# Altium project AMPURR.PrjPcb (part 2 of 2)

## Sheet ADAU1452KCPZ.SchDoc: =DocumentName
size 420 x 297 mm; Author: Kozyr.I; CompanyName: "AS Manufacturing" LLC; Organization: "AS Manufacturing" LLC; Address1: 5 Sklyarenka St.; Address2: Kyiv 04073; Address3: Ukraine; Address4: https://ajax.systems/en/; DocumentNumber: 1; Revision: v1.0.0; SheetNumber: 1; SheetTotal: 6; Product name: AMPURR; Head: AMPURR..v1.0.0; PCB_Designator: AMPURR..v1.0.0; Template_version: 1.0.1
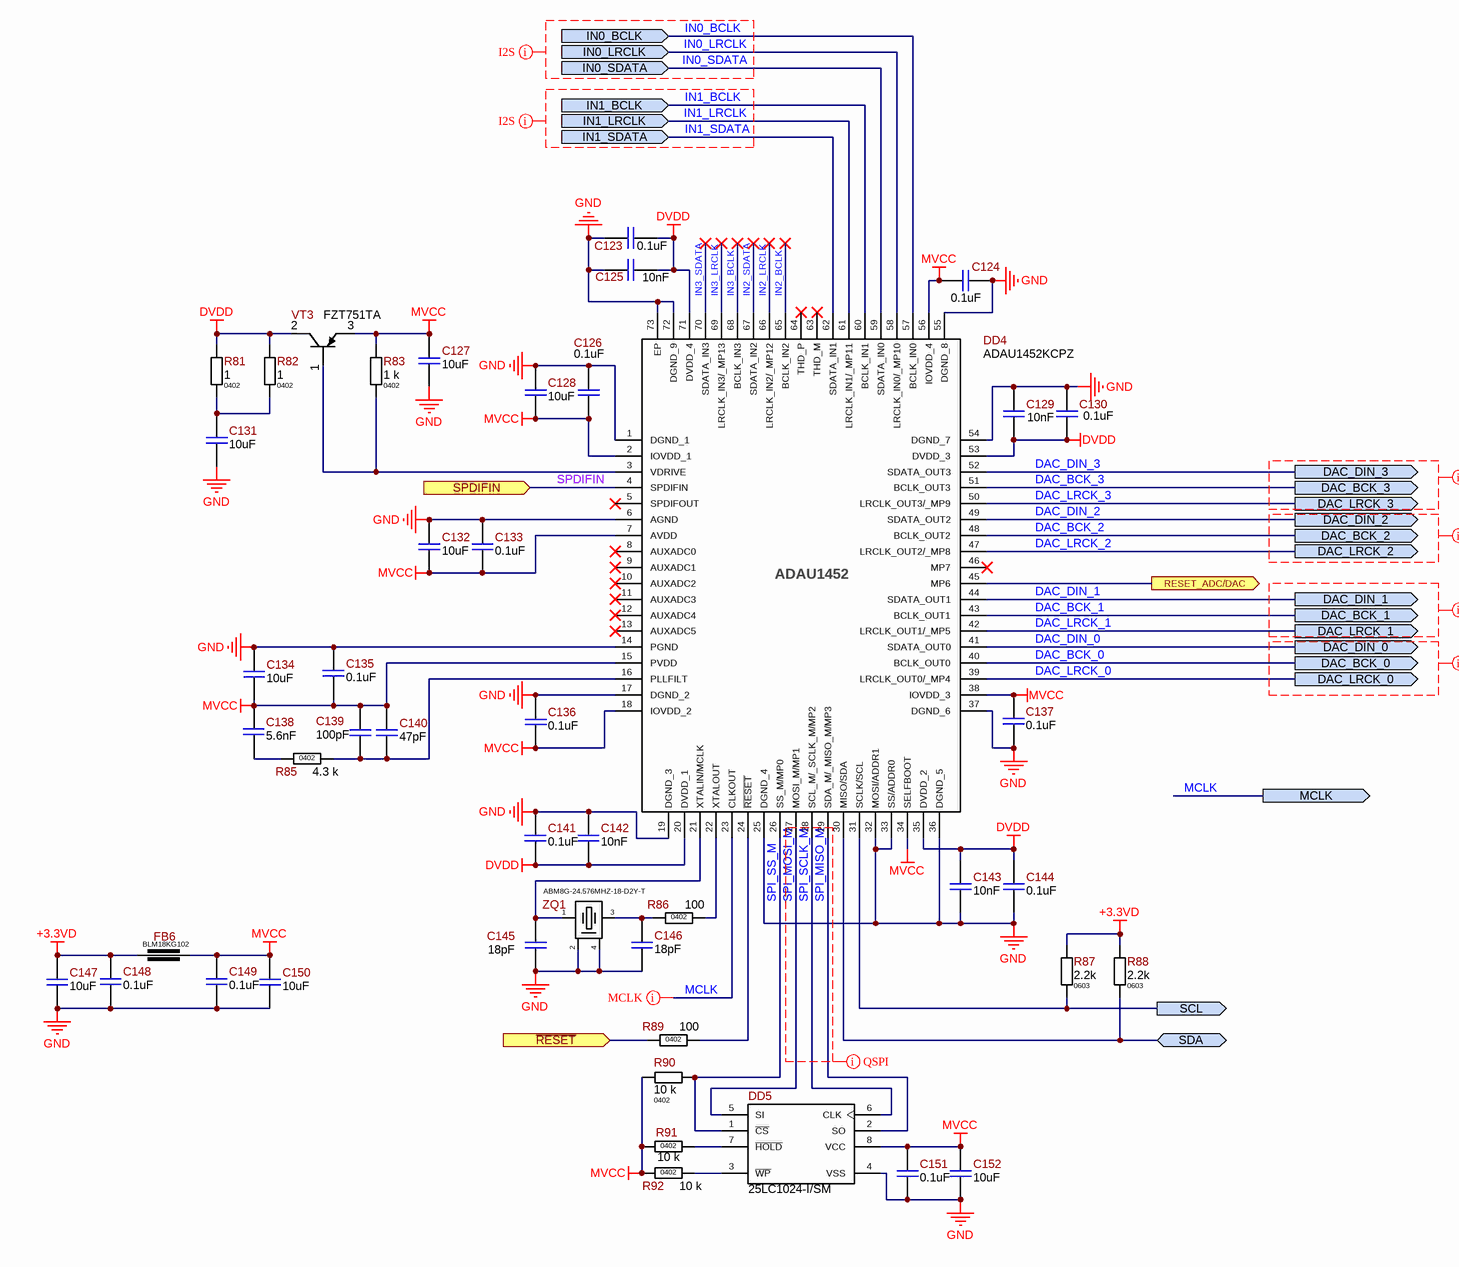
[diagram p3: ADAU1452KCPZ.SchDoc]

### Parts
C123  0.1uF  [C0402(1005)]
C124  0.1uF  [C0402(1005)]
C125  10nF  [C0402(1005)]
C126  0.1uF  [C0402(1005)]
C127  10uF  [C0402(1005)]
C128  10uF  [C0402(1005)]
C129  10nF  [C0402(1005)]
C130  0.1uF  [C0402(1005)]
C131  10uF  [C0402(1005)]
C132  10uF  [C0402(1005)]
C133  0.1uF  [C0402(1005)]
C134  10uF  [C0402(1005)]
C135  0.1uF  [C0402(1005)]
C136  0.1uF  [C0402(1005)]
C137  0.1uF  [C0402(1005)]
C138  5.6nF  [C0402(1005)]
C139  100pF  [C0402(1005)]
C140  47pF  [C0402(1005)]
C141  0.1uF  [C0402(1005)]
C142  10nF  [C0402(1005)]
C143  10nF  [C0402(1005)]
C144  0.1uF  [C0402(1005)]
C145  18pF  [C0402(1005)]
C146  18pF  [C0402(1005)]
C147  10uF  [C0402(1005)]
C148  0.1uF  [C0402(1005)]
C149  0.1uF  [C0402(1005)]
C150  10uF  [C0402(1005)]
C151  0.1uF  [C0402(1005)]
C152  10uF  [C0402(1005)]
DD4  ADAU1452KCPZ  [QFN50P1000X1000X100-73N-D]
DD5  25LC1024-I/SM  [SOIC8]
FB6  BLM18KG102  [BLM18(0603)]
R81  1  Package/Case: 0402  [R0402]
R82  1  Package/Case: 0402  [R0402]
R83  1 k  Package/Case: 0402  [R0402]
R85  4.3 k  Package/Case: 0402  [R0402]
R86  100  Package/Case: 0402  [R0402]
R87  2.2k  Package/Case: 0603  [R0603]
R88  2.2k  Package/Case: 0603  [R0603]
R89  100  Package/Case: 0402  [R0402]
R90  10 k  Package/Case: 0402  [R0402]
R91  10 k  Package/Case: 0402  [R0402]
R92  10 k  Package/Case: 0402  [R0402]
VT3  FZT751TA  [SOT-223]
ZQ1  ABM8G-24.576MHZ-18-D2Y-T  [ABM8]

### Ports
DAC_BCK_0 (out), DAC_BCK_1 (out), DAC_BCK_2 (out), DAC_BCK_3 (out), DAC_DIN_0 (out), DAC_DIN_1 (out), DAC_DIN_2 (out), DAC_DIN_3 (out), DAC_LRCK_0 (out), DAC_LRCK_1 (out), DAC_LRCK_2 (out), DAC_LRCK_3 (out), IN0_BCLK (in), IN0_LRCLK (in), IN0_SDATA (in), IN1_BCLK (in), IN1_LRCLK (in), IN1_SDATA (in), MCLK (out), RESET_ADC/DAC (out), SCL (out), SDA (bidir), SPDIFIN (in), ~{RESET} (in)

### Nets
+3.3VD: C147.2 C148.1 FB6.1 R87.1 R88.1
DVDD: C123.2 C125.2 C129.1 C130.1 C141.2 C142.2 C143.2 C144.2 DD4.20(DVDD_1) DD4.35(DVDD_2) DD4.53(DVDD_3) DD4.71(DVDD_4) R81.1 R82.1 VT3.2(C)
GND: C123.1 C124.2 C125.1 C126.2 C127.1 C128.2 C129.2 C130.2 C131.1 C132.2 C133.2 C134.2 C135.1 C136.2 C137.2 C141.1 C142.1 C143.1 C144.1 C145.1 C146.1 C147.1 C148.2 C149.2 C150.1 C151.1 C152.1 DD4.1(DGND_1) DD4.6(AGND) DD4.14(PGND) DD4.17(DGND_2) DD4.19(DGND_3) DD4.25(DGND_4) DD4.32(MOSI/ADDR1) DD4.33(SS/ADDR0) DD4.36(DGND_5) DD4.37(DGND_6) DD4.54(DGND_7) DD4.55(DGND_8) DD4.72(DGND_9) DD4.73(EP) DD5.4(VSS) ZQ1.2(Body) ZQ1.4(Body)
MVCC: C124.1 C126.1 C127.2 C128.1 C132.1 C133.1 C134.1 C135.2 C136.1 C137.1 C138.1 C139.2 C140.2 C149.1 C150.2 C151.2 C152.2 DD4.2(IOVDD_1) DD4.7(AVDD) DD4.15(PVDD) DD4.18(IOVDD_2) DD4.34(SELFBOOT) DD4.38(IOVDD_3) DD4.56(IOVDD_4) DD5.8(VCC) FB6.2 R83.1 R90.1 R91.2 R92.2 VT3.3(E)
DAC_BCK_0: DD4.40(BCLK_OUT0) ; port DAC_BCK_0
DAC_BCK_1: DD4.43(BCLK_OUT1) ; port DAC_BCK_1
DAC_BCK_2: DD4.48(BCLK_OUT2) ; port DAC_BCK_2
DAC_BCK_3: DD4.51(BCLK_OUT3) ; port DAC_BCK_3
DAC_DIN_0: DD4.41(SDATA_OUT0) ; port DAC_DIN_0
DAC_DIN_1: DD4.44(SDATA_OUT1) ; port DAC_DIN_1
DAC_DIN_2: DD4.49(SDATA_OUT2) ; port DAC_DIN_2
DAC_DIN_3: DD4.52(SDATA_OUT3) ; port DAC_DIN_3
DAC_LRCK_0: DD4.39(LRCLK_OUT0/_MP4) ; port DAC_LRCK_0
DAC_LRCK_1: DD4.42(LRCLK_OUT1/_MP5) ; port DAC_LRCK_1
DAC_LRCK_2: DD4.47(LRCLK_OUT2/_MP8) ; port DAC_LRCK_2
DAC_LRCK_3: DD4.50(LRCLK_OUT3/_MP9) ; port DAC_LRCK_3
IN0_BCLK: DD4.57(BCLK_IN0) ; port IN0_BCLK
IN0_LRCLK: DD4.58(LRCLK_IN0/_MP10) ; port IN0_LRCLK
IN0_SDATA: DD4.59(SDATA_IN0) ; port IN0_SDATA
IN1_BCLK: DD4.60(BCLK_IN1) ; port IN1_BCLK
IN1_LRCLK: DD4.61(LRCLK_IN1/_MP11) ; port IN1_LRCLK
IN1_SDATA: DD4.62(SDATA_IN1) ; port IN1_SDATA
IN2_BCLK: DD4.65(BCLK_IN2)
IN2_LRCLK: DD4.66(LRCLK_IN2/_MP12)
IN2_SDATA: DD4.67(SDATA_IN2)
IN3_BCLK: DD4.68(BCLK_IN3)
IN3_LRCLK: DD4.69(LRCLK_IN3/_MP13)
IN3_SDATA: DD4.70(SDATA_IN3)
MCLK: DD4.23(CLKOUT) ; port MCLK
SCL: DD4.31(SCLK/SCL) R87.2 ; port SCL
SDA: DD4.30(MISO/SDA) R88.2 ; port SDA
SPDIFIN: DD4.4(SPDIFIN) ; port SPDIFIN
SPI_MISO_M: DD4.29(SDA_M/_MISO_M/MP3) DD5.2(SO)
SPI_MOSI_M: DD4.27(MOSI_M/MP1) DD5.5(SI)
SPI_SCLK_M: DD4.28(SCL_M/_SCLK_M/MP2) DD5.6(CLK)
SPI_SS_M: DD4.26(SS_M/MP0) DD5.1(~{CS}) R90.2
NetC43_1: R89.2 ; port ~{RESET}
NetC131_2: C131.2 R81.2 R82.2
NetC138_2: C138.2 R85.2
NetC139_1: C139.1 C140.1 DD4.16(PLLFILT) R85.1
NetC145_2: C145.2 DD4.21(XTALIN/MCLK) ZQ1.1(X1)
NetC146_2: C146.2 R86.2 ZQ1.3(X2)
NetDD4_3: DD4.3(VDRIVE) R83.2 VT3.1(B)
NetDD4_22: DD4.22(XTALOUT) R86.1
NetDD4_24: DD4.24(~{RESET}) R89.1
NetDD4_45: DD4.45(MP6) ; port RESET_ADC/DAC
NetDD5_3: DD5.3(~{WP}) R92.1
NetDD5_7: DD5.7(~{HOLD}) R91.1

Not connected (* = marked no-connect by the designer): DD4 5(SPDIFOUT)* 8(AUXADC0)* 9(AUXADC1)* 10(AUXADC2)* 11(AUXADC3)* 12(AUXADC4)* 13(AUXADC5)* 46(MP7)* 63(THD_M)* 64(THD_P)*

### Layout directives
net class I2S0: (no net found under the mark)
net class I2S4: IN1_BCLK, IN1_LRCLK, IN1_SDATA
net class I2S5: IN0_BCLK, IN0_LRCLK, IN0_SDATA
net class I2S1: (no net found under the mark)
net class I2S2: (no net found under the mark)
net class QSPI: SPI_MISO_M, SPI_MOSI_M, SPI_SCLK_M
net class MCLK: MCLK
net class I2S3: (no net found under the mark)

### Notes on the sheet
- 1
- 2
- 3
- 4
- 5
- 6
- 7
- 8
- A
- B
- C
- D
- E
- F
- Назва проекту
- Мова
- UA
- Розробник
- Формат
- A3
- Версія
- Дата
- Лист
- /
- (in symbol ADAU1452KCPZ) ADAU1452

### Library data of the parts
C123 C124 C126 C130 C133 C135-C137 C141 C144 C148 C149 C151 = 0.1uF  25V C0403: as C40 on sheet AMPURR; Part Number: 0.1uF  25V C0403; Value: 0.1uF; Temperature Coefficient: X7R; Power (V/A): 25V; Package/Case: C0403; Supplier Part Number 1: 1276-6854-2-ND; ComponentLink1Description: Datasheet
C125 C129 C142 C143 = 10nF  50V C0402: CAP CER 10NF 50V NP0 0603; Manufacturer: AVX Corporation; Name Component: Capacitor Ceramic; Tolerance: ±0.25pF; Operation Temperature: -55°C ~ 105°C; Temperature Coefficient: C0G, NP0; Library Path 1: Capacitors.SchLib; Part Number: 10nF  50V C0402; Value: 10nF; Power (V/A): 50V; Package/Case: C0402; Supplier 1: Digi-key; ComponentLink1Description: Datasheet
C127 C128 C131 C132 C134 C147 C150 C152 = 10uF  6.3V C0402: as C39 on sheet AMPURR; Part Number: 10uF  6.3V C0402; Value: 10uF; Temperature Coefficient: X6S; Power (V/A): 6.3V; Package/Case: C0402; Supplier 1: Digi-key; Supplier Part Number 1: 490-13233-2-ND; ComponentLink1Description: Datasheet; ComponentLink1URL: https://www.murata.com/~/media/webrenewal/support/library/catalog/products/capacitor/mlcc/c02e.ashx?la=en-us
C138 = 5.6nF  50V C0402: CAP CER 5.6NF 50V NP0 0603; Manufacturer: AVX Corporation; Name Component: Capacitor Ceramic; Tolerance: ±0.25pF; Operation Temperature: -55°C ~ 105°C; Temperature Coefficient: C0G, NP0; Library Path 1: Capacitors.SchLib; Part Number: 5.6nF  50V C0402; Value: 5.6nF; Power (V/A): 50V; Package/Case: C0402; Supplier 1: Digi-key; ComponentLink1Description: Datasheet
C139 = 100pF  50V C0402: CAP CER 100PF 50V NP0 0603; Manufacturer: AVX Corporation; Name Component: Capacitor Ceramic; Tolerance: ±0.25pF; Operation Temperature: -55°C ~ 105°C; Temperature Coefficient: C0G, NP0; Library Path 1: Capacitors.SchLib; Part Number: 100pF  50V C0402; Value: 100pF; Power (V/A): 50V; Package/Case: C0402; Supplier 1: Digi-key; ComponentLink1Description: Datasheet
C140 = 47pF  50V C0402: CAP CER 47PF 50V NP0 0603; Manufacturer: AVX Corporation; Name Component: Capacitor Ceramic; Tolerance: ±0.25pF; Operation Temperature: -55°C ~ 105°C; Temperature Coefficient: C0G, NP0; Library Path 1: Capacitors.SchLib; Part Number: 47pF  50V C0402; Value: 47pF; Power (V/A): 50V; Package/Case: C0402; Supplier 1: Digi-key; ComponentLink1Description: Datasheet
C145 C146 = 18pF  50V C0402: CAP CER 18PF 50V NP0 0603; Manufacturer: AVX Corporation; Name Component: Capacitor Ceramic; Tolerance: ±0.25pF; Operation Temperature: -55°C ~ 105°C; Temperature Coefficient: C0G, NP0; Library Path 1: Capacitors.SchLib; Part Number: 18pF  50V C0402; Value: 18pF; Power (V/A): 50V; Package/Case: C0402; Supplier 1: Digi-key; ComponentLink1Description: Datasheet
DD4 = ADAU1452KCPZ: 300 MHZ 32BIT SIGMADSP AUDIO PRO; Manufacturer: Analog Devices Inc.; Name Component: Digital Signal Processors; Operation Temperature: 0°C ~ 70°C (TA); Power (V/A): ---; Library Path 1: Integrated Circuit.SchLib; Part Number: ADAU1452KCPZ; Value: ADAU1452KCPZ; Package/Case: 72-VFQFN Exposed Pad; Manufacturer P/N: ADAU1452KCPZ; Supplier 1: Digi-key; Supplier Part Number 1: 505-ADAU1452KCPZ-ND; ComponentLink1Description: Datasheet; ComponentLink1URL: https://www.analog.com/media/en/technical-documentation/data-sheets/ADAU1452_1451_1450.pdf
DD5 = 25LC1024-I/SM: EEPROM Memory IC 1Mbit SPI 20 MHz 8-SOIJ; Manufacturer: Microchip Technology; Operation Temperature: -40°C ~ 85°C (TA); Power (V/A): 2.5V ~ 5.5V; Library Path 1: Integrated Circuit.SchLib; Part Number: 25LC1024-I/SM; Name Component: Memory; Value: 25LC1024-I/SM; Package/Case: 8-SOIC; Manufacturer P/N: 25LC1024-I/SM; Supplier 1: Digi-key; Supplier Part Number 1: 25LC1024-I/SM-ND; ComponentLink1Description: Datasheet; ComponentLink1URL: https://ww1.microchip.com/downloads/aemDocuments/documents/MPD/ProductDocuments/DataSheets/25LC1024-1-Mbit-SPI-Bus-Serial-EEPROM-20002064E.pdf
FB6 = BLM18KG102: FERRITE BEAD 1 KOHM 0603 1LN; Manufacturer: Murata Electronics North America; Manufacturer P/N: BLM18KG102SN1D; Name Component: Ferrite Beads; Tolerance: ±25%; Power (V/A): 1A; Library Path 1: Inductance.SchLib; Part Number: BLM18KG102; Value: BLM18KG102; Package/Case: 0603 (1608 Metric); Supplier 1: Digi-key; Supplier Part Number 1: 490-17349-2-ND; ComponentLink1Description: Datasheet; ComponentLink1URL: https://media.digikey.com/pdf/Data%20Sheets/Murata%20PDFs/BLM18yyyyyyN1x.pdf
R81 R82 = 1  R0402: RES SMD 1 OHM  ±1% 1/16W 0402; Part Number: 1  R0402; Power Rating: 0.063W; Name Component: Resistror; Operation Temperature: -55℃ to 155℃; Temperature Coefficient: ±200 ppm/°C; Library Path 1: Resistor.SchLib; Value: 1; Tolerance: ±1%
R83 = 1 k  R0402: RES SMD 1 k OHM  ±1% 1/16W 0402; Power Rating: 0.063W; Name Component: Resistror; Operation Temperature: -55℃ to 155℃; Temperature Coefficient: ±100 ppm/°C; Library Path 1: Resistor.SchLib; Part Number: 1 k  R0402; Value: 1 k; Tolerance: ±1%
R85 = 4.3 k  R0402: RES SMD 4.3 k OHM  ±1% 1/16W 0402; Power Rating: 0.063W; Name Component: Resistror; Operation Temperature: -55℃ to 155℃; Temperature Coefficient: ±100 ppm/°C; Library Path 1: Resistor.SchLib; Part Number: 4.3 k  R0402; Value: 4.3 k; Tolerance: ±1%
R86 R89 = 100  R0402: as R80 on sheet ADC_AK5572; Part Number: 100  R0402; Value: 100; Tolerance: ±1%
R87 R88 = 10 k  R0603: RES SMD 10 k OHM  ±1% 1/10W 0603; Power Rating: 0.1W; Name Component: Resistror; Value: 10 k; Operation Temperature: -55℃ to 155℃; Temperature Coefficient: ±100 ppm/°C; Library Path 1: Resistor.SchLib; Part Number: 10 k  R0603; Tolerance: ±1%
R90-R92 = 10 k  R0402: RES SMD 10 k OHM  ±1% 1/16W 0402; Power Rating: 0.063W; Name Component: Resistror; Operation Temperature: -55℃ to 155℃; Temperature Coefficient: ±100 ppm/°C; Library Path 1: Resistor.SchLib; Part Number: 10 k  R0402; Value: 10 k; Tolerance: ±1%
VT3 = FZT751TA: Bipolar (BJT) Transistor PNP 60 V 3 A 140MHz 2 W Surface Mount SOT-223-3; Manufacturer: Diodes Incorporated; Operation Temperature: -55°C ~ 150°C (TJ); Power Rating: 60V 3A; Library Path 1: Transistors.SchLib; Part Number: FZT751TA; Name Component: Transistor; Value: FZT751TA; Package/Case: SOT-223-3; Manufacturer P/N: FZT751TA; Supplier 1: Digi-key; Supplier Part Number 1: FZT751TR-ND; ComponentLink1Description: Datasheet; ComponentLink1URL: https://www.diodes.com/assets/Datasheets/FZT751.pdf
ZQ1 = ABM8G-24.576MHZ-18-D2Y-T: CRYSTAL 24.5760MHZ 18PF SMD; Manufacturer: Abracon LLC; Manufacturer P/N: 535-10274-2-ND; Name Component: Oscillators; Tolerance: ±20ppm; Operation Temperature: -40°C ~ 85°C; Library Path 1: Resonator.SchLib; Part Number: ABM8G-24.576MHZ-18-D2Y-T; Value: ABM8G-24.576MHZ-18-D2Y-T; Package/Case: SMD; Supplier 1: Kosmodrom; Supplier Part Number 1: 00-00073443

## Sheet PHONO_PREAMP.SchDoc: =DocumentName
size 297 x 209 mm; Author: Kozyr.I; CompanyName: "AS Manufacturing" LLC; Organization: "AS Manufacturing" LLC; Address1: 5 Sklyarenka St.; Address2: Kyiv 04073; Address3: Ukraine; Address4: https://ajax.systems/en/; DocumentNumber: 5; Revision: v1.0.0; SheetNumber: 5; SheetTotal: 6; Product name: AMPURR; Head: AMPURR..v1.0.0; PCB_Designator: AMPURR..v1.0.0; Template_version: 1.0.1
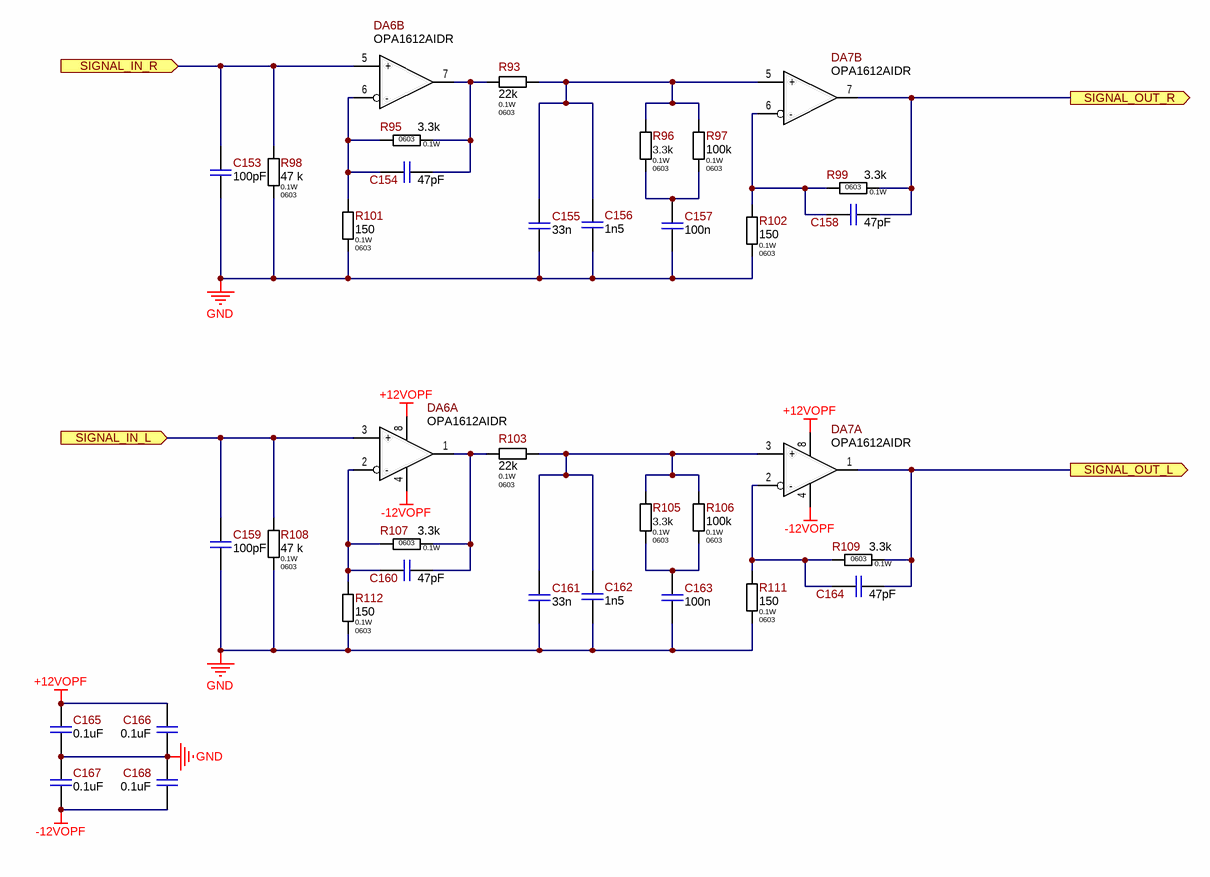
[diagram p4: PHONO_PREAMP.SchDoc]

### Parts
C153  100pF  [C0603(1608)]
C154  47pF  [C0603(1608)]
C155  33n  [WIMA_2,5x6,5x7,2]
C156  1n5  [C0603(1608)]
C157  100n  [WIMA_2,5x6,5x7,2]
C158  47pF  [C0603(1608)]
C159  100pF  [C0603(1608)]
C160  47pF  [C0603(1608)]
C161  33n  [WIMA_2,5x6,5x7,2]
C162  1n5  [C0603(1608)]
C163  100n  [WIMA_2,5x6,5x7,2]
C164  47pF  [C0603(1608)]
C165  0.1uF  [C0603(1608)]
C166  0.1uF  [C0603(1608)]
C167  0.1uF  [C0603(1608)]
C168  0.1uF  [C0603(1608)]
DA6  OPA1612AIDR  [SOIC8]  (parts A,B of 2)
DA7  OPA1612AIDR  [SOIC8]  (parts A,B of 2)
R93  22k  Power Rating: 0.1W  Package/Case: 0603  [R0603]
R95  3.3k  Power Rating: 0.1W  Package/Case: 0603  [R0603]
R96  3.3k  Power Rating: 0.1W  Package/Case: 0603  [R0603]
R97  100k  Power Rating: 0.1W  Package/Case: 0603  [R0603]
R98  47 k  Power Rating: 0.1W  Package/Case: 0603  [R0603]
R99  3.3k  Power Rating: 0.1W  Package/Case: 0603  [R0603]
R101  150  Power Rating: 0.1W  Package/Case: 0603  [R0603]
R102  150  Power Rating: 0.1W  Package/Case: 0603  [R0603]
R103  22k  Power Rating: 0.1W  Package/Case: 0603  [R0603]
R105  3.3k  Power Rating: 0.1W  Package/Case: 0603  [R0603]
R106  100k  Power Rating: 0.1W  Package/Case: 0603  [R0603]
R107  3.3k  Power Rating: 0.1W  Package/Case: 0603  [R0603]
R108  47 k  Power Rating: 0.1W  Package/Case: 0603  [R0603]
R109  3.3k  Power Rating: 0.1W  Package/Case: 0603  [R0603]
R111  150  Power Rating: 0.1W  Package/Case: 0603  [R0603]
R112  150  Power Rating: 0.1W  Package/Case: 0603  [R0603]

### Ports
SIGNAL_IN_L (in), SIGNAL_IN_R (in), SIGNAL_OUT_L (out), SIGNAL_OUT_R (out)

### Nets
+12VOPF: C165.1 C166.1 DA6.8(V+) DA7.8(V+)
-12VOPF: C167.2 C168.2 DA6.4(V-) DA7.4(V-)
GND: C153.1 C155.1 C156.2 C157.1 C159.1 C161.1 C162.2 C163.1 C165.2 C166.2 C167.1 C168.1 R98.1 R101.1 R102.1 R108.1 R111.1 R112.1
NetC153_2: C153.2 DA6.5(+) R98.2 ; port SIGNAL_IN_R
NetC154_1: C154.1 DA6.7(Out) R93.1 R95.2
NetC154_2: C154.2 DA6.6(-) R95.1 R101.2
NetC155_2: C155.2 C156.1 DA7.5(+) R93.2 R96.2 R97.2
NetC157_2: C157.2 R96.1 R97.1
NetC158_1: C158.1 DA7.7(Out) R99.2 ; port SIGNAL_OUT_R
NetC158_2: C158.2 DA7.6(-) R99.1 R102.2
NetC159_2: C159.2 DA6.3(+) R108.2 ; port SIGNAL_IN_L
NetC160_1: C160.1 DA6.1(Out) R103.1 R107.2
NetC160_2: C160.2 DA6.2(-) R107.1 R112.2
NetC161_2: C161.2 C162.1 DA7.3(+) R103.2 R105.2 R106.2
NetC163_2: C163.2 R105.1 R106.1
NetC164_1: C164.1 DA7.1(Out) R109.2 ; port SIGNAL_OUT_L
NetC164_2: C164.2 DA7.2(-) R109.1 R111.2

### Notes on the sheet
- 1
- 2
- 3
- 4
- 5
- 6
- C
- D
- E
- F
- Назва проекту
- Мова
- UA
- Розробник
- Формат
- A4
- Версія
- Дата
- Лист
- /

### Library data of the parts
C153 C159 = 100pF  50V C0603: CAP CER n1F 50V X7R 0603; Manufacturer: AVX Corporation; Manufacturer P/N: 06035C101MAT2A; Name Component: Capacitor Ceramic; Tolerance: ±20%; Operation Temperature: -55°C ~ 105°C; Notes: 06035C101MAT4A; Library Path 1: Capacitors.SchLib; Part Number: 100pF  50V C0603; Value: 100pF; Temperature Coefficient: X7R; Power (V/A): 50V; Package/Case: C0603; Supplier 1: Digi-key; Supplier Part Number 1: 06035C101MAT2A-ND; ComponentLink1Description: Datasheet; ComponentLink1URL: http://catalogs.avx.com/SurfaceMount.pdf
C154 C156 C158 C160 C162 C164 = 100pF  50V C0603: CAP CER n1F 50V X7R 0603; Manufacturer: AVX Corporation; Manufacturer P/N: 06035C101MAT2A; Name Component: Capacitor Ceramic; Value: 100pF; Tolerance: ±20%; Operation Temperature: -55°C ~ 105°C; Notes: 06035C101MAT4A; Library Path 1: Capacitors.SchLib; Part Number: 100pF  50V C0603; Temperature Coefficient: X7R; Power (V/A): 50V; Package/Case: C0603; Supplier 1: Digi-key; Supplier Part Number 1: 06035C101MAT2A-ND; ComponentLink1Description: Datasheet; ComponentLink1URL: http://catalogs.avx.com/SurfaceMount.pdf
C155 C161 = 33n  AC40V DC63V 2,5x6,5x7,2: WIMA 33NF, 40VAC, 63VDC: 5mm, ± 10%; Manufacturer P/N: MKS2-33N/63; Name Component: Polypropylene (PP), Metallized; Temperature Coefficient: pp; Library Path 1: Capacitors.SchLib; Part Number: 33n  AC40V DC63V 2,5x6,5x7,2; Value: 33n; Tolerance: 10%; Power (V/A): AC40V DC63V; Package/Case: 2,5x6,5x7,2; Manufacturer: WIMA; Supplier 1: kosmodrom; ComponentLink1Description: Datasheet
C157 C163 = 100n  AC40V DC63V 2,5x6,5x7,2: WIMA 100NF, 40VAC, 63VDC: 5mm, ± 10%; Manufacturer P/N: MKS2-100N/63; Name Component: Polypropylene (PP), Metallized; Temperature Coefficient: pp; Library Path 1: Capacitors.SchLib; Part Number: 100n  AC40V DC63V 2,5x6,5x7,2; Value: 100n; Tolerance: 10%; Power (V/A): AC40V DC63V; Package/Case: 2,5x6,5x7,2; Manufacturer: WIMA; Supplier 1: kosmodrom; ComponentLink1Description: Datasheet
C165-C168 = 0.1uF  50V C0603: CAP CER 0.1UF 50V X7R 0603; Manufacturer: Samsung Electro-Mechanics; Manufacturer P/N: CL10B104KB8WPNC; Name Component: Capacitor Ceramic; Tolerance: ±10%; Operation Temperature: -55°C ~ 125°C; Notes: 06035C104K4T4A, 06035C104K4T2A; Library Path 1: Capacitors.SchLib; Part Number: 0.1uF  50V C0603; Value: 0.1uF; Temperature Coefficient: X7R; Power (V/A): 50V; Package/Case: C0603; Supplier 1: Digi-key; Supplier Part Number 1: 1276-6854-2-ND; ComponentLink1Description: Datasheet; ComponentLink1URL: https://www.samsungsem.com/resources/file/global/support/product_catalog/MLCC.pdf
DA6 DA7 = OPA1612AIDR: as DA3 on sheet ADC_AK5572; ComponentLink1URL: https://www.ti.com/general/docs/suppproductinfo.tsp?distId=10&gotoUrl=https%3A%2F%2Fwww.ti.com%2Flit%2Fgpn%2Fopa1611; ComponentLink1Description: Datasheet; Part Number: OPA1612AIDR; Value: OPA1612AIDR; Package/Case: 8-SOIC; Manufacturer P/N: OPA1612AIDR; Supplier 1: Digi-key; Supplier Part Number 1: 296-39098-6-ND
R93 R97 R103 R106 = 750  R0603: RES SMD 750 OHM  ±1% 1/10W 0603; Name Component: Resistror; Value: 750; Operation Temperature: -55℃ to 155℃; Temperature Coefficient: ±100 ppm/°C; Library Path 1: Resistor.SchLib; Part Number: 750  R0603; Tolerance: ±1%
R95 R96 R99 R105 R107 R109 = 100 k  R0603: RES SMD 100 k OHM  ±1% 1/10W 0603; Name Component: Resistror; Value: 100 k; Operation Temperature: -55℃ to 155℃; Temperature Coefficient: ±100 ppm/°C; Library Path 1: Resistor.SchLib; Part Number: 100 k  R0603; Tolerance: ±1%
R98 R108 = 47 k  R0603: RES SMD 47 k OHM  ±1% 1/10W 0603; Name Component: Resistror; Operation Temperature: -55℃ to 155℃; Temperature Coefficient: ±100 ppm/°C; Library Path 1: Resistor.SchLib; Part Number: 47 k  R0603; Value: 47 k; Tolerance: ±1%
R101 R102 R111 R112 = 4.7 k  R0603: RES SMD 4.7 k OHM  ±1% 1/10W 0603; Name Component: Resistror; Value: 4.7 k; Operation Temperature: -55℃ to 155℃; Temperature Coefficient: ±100 ppm/°C; Library Path 1: Resistor.SchLib; Part Number: 4.7 k  R0603; Tolerance: ±1%

## Sheet DAC_AK4493SEQ.SchDoc: =DocumentName
size 420 x 297 mm; Author: Kozyr.I; CompanyName: "AS Manufacturing" LLC; Organization: "AS Manufacturing" LLC; Address1: 5 Sklyarenka St.; Address2: Kyiv 04073; Address3: Ukraine; Address4: https://ajax.systems/en/; DocumentNumber: 4; Revision: v1.0.0; SheetNumber: 4; SheetTotal: 6; Product name: AMPURR; Head: AMPURR..v1.0.0; PCB_Designator: AMPURR..v1.0.0; Template_version: 1.0.1
Used 3 times, as channels U_DAC_AK4493SEQ, U_DAC_AK4493SEQ, U_DAC_AK4493SEQ. Parts and nets are listed once, with the designators drawn on the sheet.
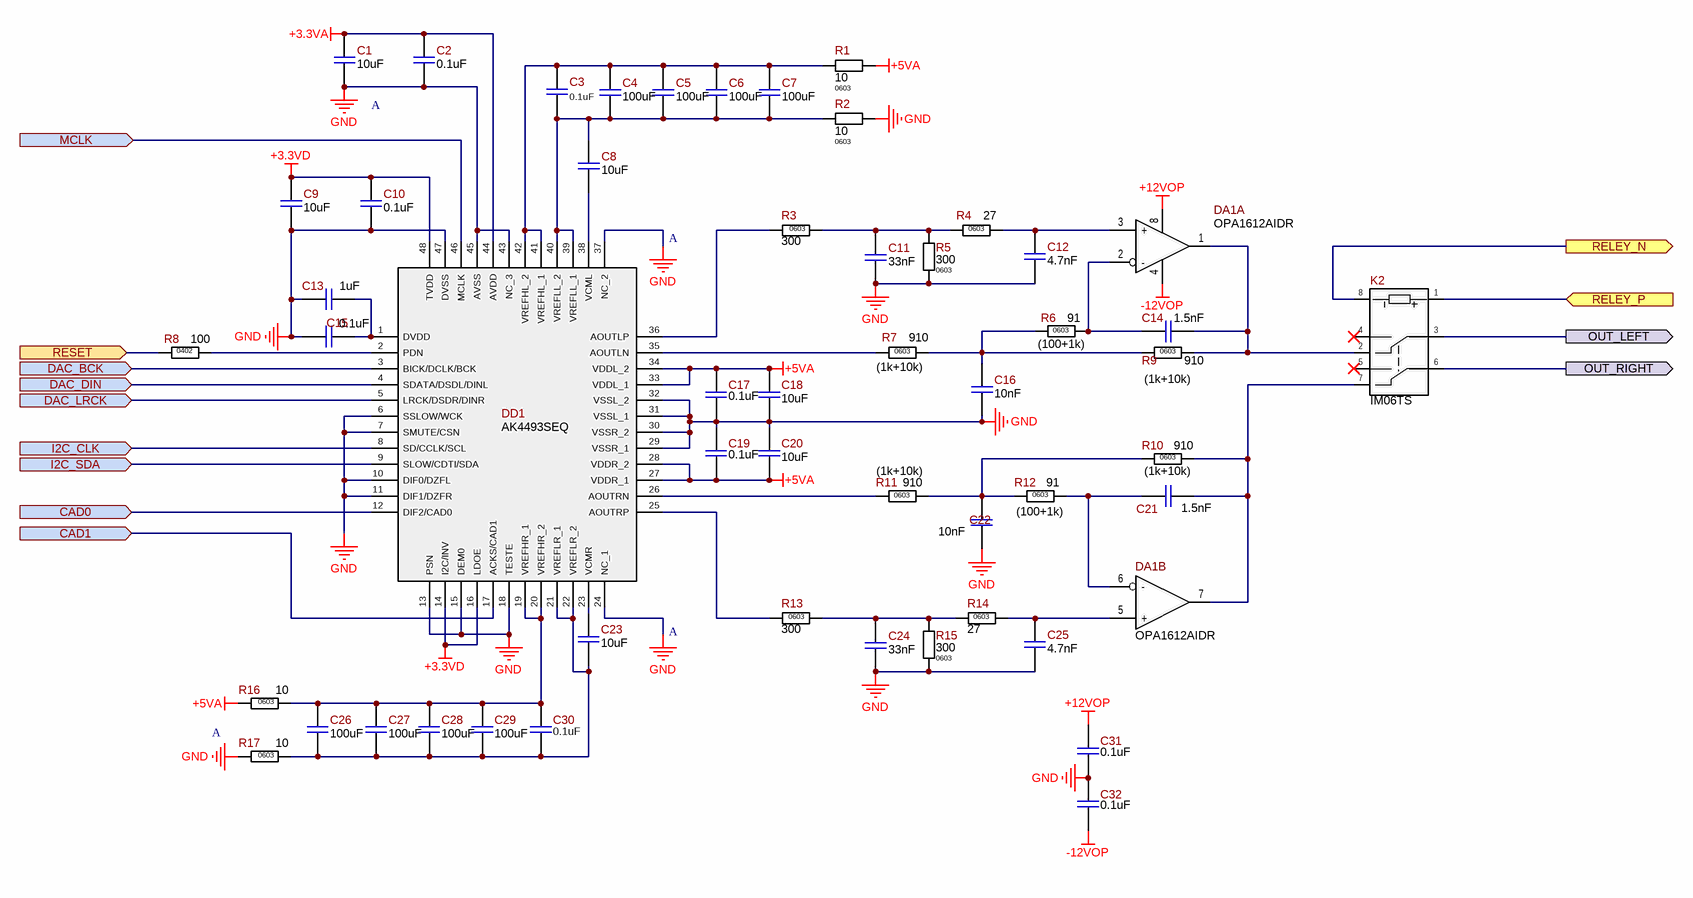
[diagram p5: DAC_AK4493SEQ.SchDoc]

### Parts
C1  10uF  [C0402(1005)]
C2  0.1uF  [C0402(1005)]
C3  0.1uF  [C0402(1005)]
C4  100uF  [C1206(3216)]
C5  100uF  [C1206(3216)]
C6  100uF  [C1206(3216)]
C7  100uF  [C1206(3216)]
C8  10uF  [C0402(1005)]
C9  10uF  [C0402(1005)]
C10  0.1uF  [C0402(1005)]
C11  33nF  [C0603(1608)]
C12  4.7nF  [C0603(1608)]
C13  1uF  [C0402(1005)]
C14  1.5nF  [C0603(1608)]
C15  0.1uF  [C0402(1005)]
C16  10nF  [C0603(1608)]
C17  0.1uF  [C0402(1005)]
C18  10uF  [C0402(1005)]
C19  0.1uF  [C0402(1005)]
C20  10uF  [C0402(1005)]
C21  1.5nF  [C0603(1608)]
C22  10nF  [C0603(1608)]
C23  10uF  [C0402(1005)]
C24  33nF  [C0603(1608)]
C25  4.7nF  [C0603(1608)]
C26  100uF  [C1206(3216)]
C27  100uF  [C1206(3216)]
C28  100uF  [C1206(3216)]
C29  100uF  [C1206(3216)]
C30  0.1uF  [C0402(1005)]
C31  0.1uF  [C0603(1608)]
C32  0.1uF  [C0603(1608)]
DA1  OPA1612AIDR  [SOIC8]  (parts A,B of 2)
DD1  AK4493SEQ  [LQFP48]
K2  IM06TS  [IM06]
R1  10  Package/Case: 0603  [R0603]
R2  10  Package/Case: 0603  [R0603]
R3  300  Package/Case: 0603  [R0603]
R4  27  Package/Case: 0603  [R0603]
R5  300  Package/Case: 0603  [R0603]
R6  91  Package/Case: 0603  [R0603]
R7  910  Package/Case: 0603  [R0603]
R8  100  Package/Case: 0402  [R0402]
R9  910  Package/Case: 0603  [R0603]
R10  910  Package/Case: 0603  [R0603]
R11  910  Package/Case: 0603  [R0603]
R12  91  Package/Case: 0603  [R0603]
R13  300  Package/Case: 0603  [R0603]
R14  27  Package/Case: 0603  [R0603]
R15  300  Package/Case: 0603  [R0603]
R16  10  Package/Case: 0603  [R0603]
R17  10  Package/Case: 0603  [R0603]

### Ports
CAD0 (in), CAD1 (in), DAC_BCK (in), DAC_DIN (in), DAC_LRCK (in), I2C_CLK (in), I2C_SDA (in), MCLK (in), OUT_LEFT (out), OUT_RIGHT (out), RELEY_N (out), RELEY_P (in), RESET (in)

### Nets
+3.3VA: C1.1 C2.1 DD1.44(AVDD)
+3.3VD: C9.1 C10.1 DD1.14(I2C/INV) DD1.16(LDOE) DD1.48(TVDD)
+5VA: C17.1 C18.1 C19.2 C20.2 DD1.27(VDDR_1) DD1.28(VDDR_2) DD1.33(VDDL_1) DD1.34(VDDL_2) R1.2 R16.2
+12VOP: C31.1 DA1.8(V+)
-12VOP: C32.2 DA1.4(V-)
GND: C1.2 C2.2 C9.2 C10.2 C11.1 C12.2 C13.2 C15.2 C16.2 C17.2 C18.2 C19.1 C20.1 C22.2 C24.1 C25.2 C31.2 C32.1 DD1.6(SSLOW/WCK) DD1.7(SMUTE/CSN) DD1.10(DIF0/DZFL) DD1.11(DIF1/DZFR) DD1.13(PSN) DD1.15(DEM0) DD1.18(TESTE) DD1.24(NC_1) DD1.29(VSSR_1) DD1.30(VSSR_2) DD1.31(VSSL_1) DD1.32(VSSL_2) DD1.37(NC_2) DD1.43(NC_3) DD1.45(AVSS) DD1.47(DVSS) R2.2 R5.2 R15.2 R17.2
CAD0: DD1.12(DIF2/CAD0) ; port CAD0
CAD1: DD1.17(ACKS/CAD1) ; port CAD1
DAC_BCK: DD1.3(BICK/DCLK/BCK) ; port DAC_BCK
DAC_DIN: DD1.4(SDATA/DSDL/DINL) ; port DAC_DIN
DAC_LRCK: DD1.5(LRCK/DSDR/DINR) ; port DAC_LRCK
I2C_CLK: DD1.8(SD/CCLK/SCL) ; port I2C_CLK
I2C_SDA: DD1.9(SLOW/CDTI/SDA) ; port I2C_SDA
MCLK: DD1.46(MCLK) ; port MCLK
OUT_LEFT: K2.3(1-COM) ; port OUT_LEFT
OUT_RIGHT: K2.6 ; port OUT_RIGHT
RELEY_N: K2.8(2-COM) ; port RELEY_N
RELEY_P: K2.1(Coil+) ; port RELEY_P
RESET: R8.1 ; port RESET
NetC3_1: C3.1 C4.2 C5.2 C6.2 C7.2 DD1.41(VREFHL_1) DD1.42(VREFHL_2) R1.1
NetC3_2: C3.2 C4.1 C5.1 C6.1 C7.1 C8.1 DD1.39(VREFLL_1) DD1.40(VREFLL_2) R2.1
NetC8_2: C8.2 DD1.38(VCML)
NetC11_2: C11.2 R3.1 R4.2 R5.1
NetC12_1: C12.1 DA1.3(+) R4.1
NetC13_1: C13.1 C15.1 DD1.1(DVDD)
NetC14_1: C14.1 DA1.1(Out) K2.2(1-CLOSED) R9.1
NetC14_2: C14.2 DA1.2(-) R6.2
NetC16_1: C16.1 R6.1 R7.1 R9.2
NetC21_1: C21.1 DA1.7(Out) K2.7(2-OPEN) R10.1
NetC21_2: C21.2 DA1.6(-) R12.1
NetC22_1: C22.1 R10.2 R11.1 R12.2
NetC23_1: C23.1 DD1.23(VCMR)
NetC23_2: C23.2 C26.2 C27.2 C28.2 C29.2 C30.2 DD1.21(VREFLR_1) DD1.22(VREFLR_2) R17.1
NetC24_2: C24.2 R13.1 R14.2 R15.1
NetC25_1: C25.1 DA1.5(+) R14.1
NetC26_1: C26.1 C27.1 C28.1 C29.1 C30.1 DD1.19(VREFHR_1) DD1.20(VREFHR_2) R16.1
NetDD1_2: DD1.2(PDN) R8.2
NetDD1_25: DD1.25(AOUTRP) R13.2
NetDD1_26: DD1.26(AOUTRN) R11.2
NetDD1_35: DD1.35(AOUTLN) R7.2
NetDD1_36: DD1.36(AOUTLP) R3.2

Not connected (* = marked no-connect by the designer): K2 4(1-OPEN)* 5*

### Channels
U_DAC_AK4493SEQ: designators C1=C1A C2=C2A C3=C3A C4=C4A C5=C5C C6=C6A#1 C7=C6C#1 C8=C8A C9=C9A C10=C10A C11=C11A C12=C12A C13=C13A C14=C15A C15=C14A C16=C16A C17=C17A C18=C18A C19=C19A C20=C20A C21=C21A C22=C22A C23=C23A C24=C24A C25=C25A C26=C27C C27=C28A C28=C29C#1 C29=C29A#1 C30=C30A C31=C31A C32=C32A DA1=DA1A DD1=DD1A K2=K2A R1=R1C R2=R2C R3=R3A R4=R4A R5=R5A R6=R7A R7=R6A R8=R8A R9=R9A R10=R10A R11=R11A R12=R12A R13=R13A R14=R14A R15=R15A R16=R17C R17=R18C; ports CAD0=GND CAD1=GND DAC_BCK=DAC_BCK_0 DAC_DIN=DAC_DIN_0 DAC_LRCK=DAC_LRCK_0 I2C_CLK=SCL I2C_SDA=SDA MCLK=MCLK OUT_LEFT=NetK2A_3 OUT_RIGHT=NetK2A_6 RELEY_N=NetK2A_8 RELEY_P=NetK2A_1 RESET=NetR8A_1
U_DAC_AK4493SEQ: designators C1=C1B C2=C2B C3=C3B C4=C4B C5=C5B C6=C6B#1 C7=C6B#2 C8=C8B C9=C9B C10=C10B C11=C11B C12=C12B C13=C13B C14=C15B C15=C14B C16=C16B C17=C17B C18=C18B C19=C19B C20=C20B C21=C21B C22=C22B C23=C23B C24=C24B C25=C25B C26=C27B C27=C28B C28=C29B#1 C29=C29B#2 C30=C30B C31=C31B C32=C32B DA1=DA1B DD1=DD1B K2=K2B R1=R1B R2=R2B R3=R3B R4=R4B R5=R5B R6=R7B R7=R6B R8=R8B R9=R9B R10=R10B R11=R11B R12=R12B R13=R13B R14=R14B R15=R15B R16=R17B R17=R18B; ports CAD0=+3.3VD CAD1=GND DAC_BCK=DAC_BCK_1 DAC_DIN=DAC_DIN_1 DAC_LRCK=DAC_LRCK_1 I2C_CLK=SCL I2C_SDA=SDA MCLK=MCLK OUT_LEFT=NetK2B_3 OUT_RIGHT=NetK2B_6 RELEY_N=NetK2A_8 RELEY_P=NetK2A_1 RESET=NetR8A_1
U_DAC_AK4493SEQ: designators C1=C1C C2=C2C C3=C3C C4=C4C C5=C5A C6=C6C#2 C7=C6A#2 C8=C8C C9=C9C C10=C10C C11=C11C C12=C12C C13=C13C C14=C15C C15=C14C C16=C16C C17=C17C C18=C18C C19=C19C C20=C20C C21=C21C C22=C22C C23=C23C C24=C24C C25=C25C C26=C27A C27=C28C C28=C29A#2 C29=C29C#2 C30=C30C C31=C31C C32=C32C DA1=DA1C DD1=DD1C K2=K2C R1=R1A R2=R2A R3=R3C R4=R4C R5=R5C R6=R7C R7=R6C R8=R8C R9=R9C R10=R10C R11=R11C R12=R12C R13=R13C R14=R14C R15=R15C R16=R17A R17=R18A; ports CAD0=GND CAD1=+3.3VD DAC_BCK=DAC_BCK_2 DAC_DIN=DAC_DIN_2 DAC_LRCK=DAC_LRCK_2 I2C_CLK=SCL I2C_SDA=SDA MCLK=MCLK OUT_LEFT=NetK2C_3 OUT_RIGHT=NetK2C_6 RELEY_N=NetK2A_8 RELEY_P=NetK2A_1 RESET=NetR8A_1

### Notes on the sheet
- A
- (near DD1) A
- (near R7) (1k+10k)
- (near R6) (100+1k)
- (near R9) (1k+10k)
- (near R11) (1k+10k)
- (near R12) (100+1k)
- (near R10) (1k+10k)
- 1
- 2
- 3
- 4
- 5
- 6
- 7
- 8
- B
- C
- D
- E
- F
- Назва проекту
- Мова
- UA
- Розробник
- Формат
- A3
- Версія
- Дата
- Лист
- /

### Library data of the parts
C1 C8 C9 C18 C20 C23 = 10uF  6.3V C0402: CAP CER 10UF 6.3V X6S 0402; Manufacturer: Murata Electronics North America; Manufacturer P/N: GRM155C80J106ME11D; Name Component: Capacitor Ceramic; Tolerance: ±20%; Operation Temperature: -55°C ~ 105°C; Library Path 1: Capacitors.SchLib; Part Number: 10uF  6.3V C0402; Value: 10uF; Temperature Coefficient: X6S; Power (V/A): 6.3V; Package/Case: C0402; Supplier 1: Digi-key; Supplier Part Number 1: 490-13233-2-ND; ComponentLink1Description: Datasheet; ComponentLink1URL: https://www.murata.com/~/media/webrenewal/support/library/catalog/products/capacitor/mlcc/c02e.ashx?la=en-us
C2 C3 C10 C15 C17 C19 = 0.1uF  25V C0403: CAP CER 0.1UF 25V X7R 0603; Manufacturer: Samsung Electro-Mechanics; Name Component: Capacitor Ceramic; Tolerance: ±10%; Operation Temperature: -55°C ~ 125°C; Library Path 1: Capacitors.SchLib; Part Number: 0.1uF  25V C0403; Value: 0.1uF; Temperature Coefficient: X7R; Power (V/A): 25V; Package/Case: C0403; Supplier Part Number 1: 1276-6854-2-ND; ComponentLink1Description: Datasheet
C4-C7 C26-C29 = 100uF  10V С1206: CAP CER 100UF 10V X5T 1206; Name Component: Capacitor Ceramic; Tolerance: ±20%; Operation Temperature: -55°C ~ 105°C; Temperature Coefficient: X5R; Library Path 1: Capacitors.SchLib; Part Number: 100uF  10V С1206; Value: 100uF; Power (V/A): 10V; Package/Case: С1206; Supplier 1: Digi-key; ComponentLink1Description: Datasheet
C11 C24 = 33nF  25V C0603: CAP CER 0.033UF 25V X7R 0603; Manufacturer: AVX Corporation; Manufacturer P/N: 06033C333M4T2A; Name Component: Capacitor Ceramic; Tolerance: ±20%; Operation Temperature: -55°C ~ 105°C; Library Path 1: Capacitors.SchLib; Part Number: 33nF  25V C0603; Value: 33nF; Temperature Coefficient: X7R; Power (V/A): 25V; Package/Case: C0603; Supplier 1: Digi-key; Supplier Part Number 1: 06033C333M4T2A-ND; ComponentLink1Description: Datasheet; ComponentLink1URL: http://catalogs.avx.com/SurfaceMount.pdf
C12 C25 = 4.7nF  16V C0603: CAP CER 4.7nF 16V X7R 0603; Manufacturer: AVX Corporation; Manufacturer P/N: 0603YC472KAT2A; Name Component: Capacitor Ceramic; Tolerance: ±10%; Operation Temperature: -55°C ~ 105°C; Library Path 1: Capacitors.SchLib; Part Number: 4.7nF  16V C0603; Value: 4.7nF; Temperature Coefficient: X7R; Power (V/A): 16V; Package/Case: C0603; Supplier 1: Digi-key; Supplier Part Number 1: 0603YC472KAT2A-ND; ComponentLink1Description: Datasheet; ComponentLink1URL: http://catalogs.avx.com/SurfaceMount.pdf
C13 = 1uF  10V C0402: CAP CER 1UF 10V X7S 0402; Manufacturer: Murata Electronics North America; Manufacturer P/N: GRM155C71A105KE11D; Name Component: Capacitor Ceramic; Tolerance: ±10%; Operation Temperature: -55°C ~ 105°C; Library Path 1: Capacitors.SchLib; Part Number: 1uF  10V C0402; Value: 1uF; Temperature Coefficient: X7S; Power (V/A): 10V; Package/Case: C0402; Supplier 1: Digi-key; Supplier Part Number 1: 490-14457-2-ND; ComponentLink1Description: Datasheet; ComponentLink1URL: https://www.murata.com/~/media/webrenewal/support/library/catalog/products/capacitor/mlcc/c02e.ashx?la=en-us
C14 C21 = 1.5nF  25V C0603: CAP CER 1.5nF 25V X7R 0603; Manufacturer: AVX Corporation; Manufacturer P/N: 06033C152KAT2A; Name Component: Capacitor Ceramic; Tolerance: ±10%; Operation Temperature: -55°C ~ 105°C; Library Path 1: Capacitors.SchLib; Part Number: 1.5nF  25V C0603; Value: 1.5nF; Temperature Coefficient: X7R; Power (V/A): 25V; Package/Case: C0603; Supplier 1: Digi-key; Supplier Part Number 1: 06033C152KAT2A-ND; ComponentLink1Description: Datasheet; ComponentLink1URL: http://catalogs.avx.com/SurfaceMount.pdf
C16 C22 = 10nF  10V C0603: CAP CER 10nF 10V X5R 0603; Manufacturer: AVX Corporation; Manufacturer P/N: 0603ZD103KAT2A; Name Component: Capacitor Ceramic; Tolerance: ±10%; Operation Temperature: -55°C ~ 105°C; Library Path 1: Capacitors.SchLib; Part Number: 10nF  10V C0603; Value: 10nF; Temperature Coefficient: X5R; Power (V/A): 10V; Package/Case: C0603; Supplier 1: Digi-key; Supplier Part Number 1: 0603ZD103KAT2A-ND; ComponentLink1Description: Datasheet; ComponentLink1URL: http://catalogs.avx.com/SurfaceMount.pdf
C30 = 0.1uF  25V C0403: CAP CER 0.1UF 25V X7R 0402; Manufacturer: Samsung Electro-Mechanics; Name Component: Capacitor Ceramic; Tolerance: ±10%; Operation Temperature: -55°C ~ 125°C; Library Path 1: Capacitors.SchLib; Part Number: 0.1uF  25V C0403; Value: 0.1uF; Temperature Coefficient: X7R; Power (V/A): 25V; Package/Case: C0403; Supplier Part Number 1: 1276-6854-2-ND; ComponentLink1Description: Datasheet
C31 C32 = 0.1uF  50V C0603: CAP CER 0.1UF 50V X7R 0603; Manufacturer: Samsung Electro-Mechanics; Manufacturer P/N: CL10B104KB8WPNC; Name Component: Capacitor Ceramic; Tolerance: ±10%; Operation Temperature: -55°C ~ 125°C; Library Path 1: Capacitors.SchLib; Notes: 06035C104K4T4A, 06035C104K4T2A; Part Number: 0.1uF  50V C0603; Value: 0.1uF; Temperature Coefficient: X7R; Power (V/A): 50V; Package/Case: C0603; Supplier Part Number 1: 1276-6854-2-ND; ComponentLink1Description: Datasheet; Supplier 1: Digi-key; ComponentLink1URL: https://www.samsungsem.com/resources/file/global/support/product_catalog/MLCC.pdf
DA1 = OPA1612AIDR: Audio Amplifier 2 Circuit Rail-to-Rail 8-SOIC; Manufacturer: Texas Instruments; Name Component: Operational amplifier; Operation Temperature: -40°C ~ 85°C; Power (V/A): 4.5V-36; Library Path 1: Integrated Circuit.SchLib; ComponentLink1URL: https://www.ti.com/general/docs/suppproductinfo.tsp?distId=10&gotoUrl=https%3A%2F%2Fwww.ti.com%2Flit%2Fgpn%2Fopa1611; ComponentLink1Description: Datasheet; Part Number: OPA1612AIDR; Value: OPA1612AIDR; Package/Case: 8-SOIC; Manufacturer P/N: OPA1612AIDR; Supplier 1: Digi-key; Supplier Part Number 1: 296-39098-6-ND
DD1 = AK4493SEQ: IC DAC/AUDIO 32BIT 768K 48LQFP (7x7); Manufacturer: Asahi Kasei Microdevices/AKM; Name Component: Audio DAC; Operation Temperature: -40°C ~ 85°C; Power (V/A): ---; Library Path 1: Integrated Circuit.SchLib; Part Number: AK4493SEQ; Value: AK4493SEQ; Package/Case: 48-LQFP; Manufacturer P/N: AK4493SEQ; Supplier 1: Digi-key; Supplier Part Number 1: 974-AK4493SEQDKR-ND; ComponentLink1Description: Datasheet; ComponentLink1URL: https://www.akm.com/global/en/products/audio/audio-dac/ak4493seq/
K2 = IM06TS: RELAY TELECOM DPDT 2A 12V coil current 11.6 mA; Manufacturer_Name: Hongfa; Manufacturer_Part_Number: HFD31/5; Power (V/A): 12V 11.6 mA; Library Path 1: Others.SchLib; Datasheet Link: https://source.hongfa.com//Api/DownloadPdf/152; Height: 5.4mm; Arrow Part Number: HFD31/5; Arrow Price/Stock: https://www.arrow.com/en/products/hfd315/hongfa-europe-gmbh?region=europe; Part Number: IM06TS; Name Component: Relay; Value: IM06TS; Supplier 1: Kosmodrom; ComponentLink1Description: Datasheet; ComponentLink1URL: https://www.te.com/usa-en/product-2-1462037-7.datasheet.pdf
R1 R2 R16 R17 = 10  R0603: RES SMD 10 OHM  ±1% 1/10W 0603; Power Rating: 0.1W; Name Component: Resistror; Operation Temperature: -55℃ to 155℃; Temperature Coefficient: ±200 ppm/°C; Library Path 1: Resistor.SchLib; Part Number: 10  R0603; Value: 10; Tolerance: ±1%
R3 R5 R13 R15 = 300  R0603: RES SMD 300 OHM  ±1% 1/10W 0603; Power Rating: 0.1W; Name Component: Resistror; Operation Temperature: -55℃ to 155℃; Temperature Coefficient: ±100 ppm/°C; Library Path 1: Resistor.SchLib; Part Number: 300  R0603; Value: 300; Tolerance: ±1%
R4 R14 = 27  R0603: RES SMD 27 OHM  ±1% 1/10W 0603; Power Rating: 0.1W; Name Component: Resistror; Operation Temperature: -55℃ to 155℃; Temperature Coefficient: ±100 ppm/°C; Library Path 1: Resistor.SchLib; Part Number: 27  R0603; Value: 27; Tolerance: ±1%
R6 R12 = 91  R0603: RES SMD 91 OHM  ±1% 1/10W 0603; Power Rating: 0.1W; Name Component: Resistror; Operation Temperature: -55℃ to 155℃; Temperature Coefficient: ±100 ppm/°C; Library Path 1: Resistor.SchLib; Part Number: 91  R0603; Value: 91; Tolerance: ±1%
R7 R9-R11 = 910  R0603: RES SMD 910 OHM  ±1% 1/10W 0603; Power Rating: 0.1W; Name Component: Resistror; Operation Temperature: -55℃ to 155℃; Temperature Coefficient: ±100 ppm/°C; Library Path 1: Resistor.SchLib; Part Number: 910  R0603; Value: 910; Tolerance: ±1%
R8 = 100  R0402: RES SMD 100 OHM  ±1% 1/16W 0402; Power Rating: 0.063W; Name Component: Resistror; Operation Temperature: -55℃ to 155℃; Temperature Coefficient: ±100 ppm/°C; Library Path 1: Resistor.SchLib; Part Number: 100  R0402; Value: 100; Tolerance: ±1%

## Nets that join several sheets
12V0: AMPURR (R37.2 XP1.1), POWER (11 pins)
+3.3VA: POWER (C50.1 R27.2 U2.9 U2.10), U_DAC_AK4493SEQ (C1A.1 C2A.1 DD1A.44), U_DAC_AK4493SEQ (C1B.1 C2B.1 DD1B.44), U_DAC_AK4493SEQ (C1C.1 C2C.1 DD1C.44)
+3.3VD: AMPURR (10 pins), ADC_AK5572 (7 pins), POWER (9 pins), ADAU1452KCPZ (5 pins), U_DAC_AK4493SEQ (5 pins), U_DAC_AK4493SEQ (6 pins), U_DAC_AK4493SEQ (6 pins)
+5VA: ADC_AK5572 (5 pins), POWER (C47.1 R26.2 U1.9 U1.10), U_DAC_AK4493SEQ (10 pins), U_DAC_AK4493SEQ (10 pins), U_DAC_AK4493SEQ (10 pins)
+12VOP: ADC_AK5572 (R52.1), POWER (C63.1 R36.1 U3.9 U3.10), U_DAC_AK4493SEQ (C31A.1 DA1A.8), U_DAC_AK4493SEQ (C31B.1 DA1B.8), U_DAC_AK4493SEQ (C31C.1 DA1C.8)
+12VOPF: ADC_AK5572 (10 pins), PHONO_PREAMP (C165.1 C166.1 DA6.8 DA7.8)
-12V0: AMPURR (XP1.3), POWER (C68.2 C69.1 C70.2 FB5.1)
-12VOP: ADC_AK5572 (R59.2), POWER (5 pins), U_DAC_AK4493SEQ (C32A.2 DA1A.4), U_DAC_AK4493SEQ (C32B.2 DA1B.4), U_DAC_AK4493SEQ (C32C.2 DA1C.4)
-12VOPF: ADC_AK5572 (10 pins), PHONO_PREAMP (C167.2 C168.2 DA6.4 DA7.4)
GND: AMPURR (41 pins), ADC_AK5572 (59 pins), POWER (55 pins), ADAU1452KCPZ (44 pins), PHONO_PREAMP (18 pins), U_DAC_AK4493SEQ (40 pins), U_DAC_AK4493SEQ (39 pins), U_DAC_AK4493SEQ (39 pins)
DAC_BCK_0: ADAU1452KCPZ (DD4.40), U_DAC_AK4493SEQ (DD1A.3)
DAC_BCK_1: ADAU1452KCPZ (DD4.43), U_DAC_AK4493SEQ (DD1B.3)
DAC_BCK_2: ADAU1452KCPZ (DD4.48), U_DAC_AK4493SEQ (DD1C.3)
DAC_BCK_3: AMPURR (DD2.13), ADAU1452KCPZ (DD4.51)
DAC_DIN_0: ADAU1452KCPZ (DD4.41), U_DAC_AK4493SEQ (DD1A.4)
DAC_DIN_1: ADAU1452KCPZ (DD4.44), U_DAC_AK4493SEQ (DD1B.4)
DAC_DIN_2: ADAU1452KCPZ (DD4.49), U_DAC_AK4493SEQ (DD1C.4)
DAC_DIN_3: AMPURR (DD2.15), ADAU1452KCPZ (DD4.52)
DAC_LRCK_0: ADAU1452KCPZ (DD4.39), U_DAC_AK4493SEQ (DD1A.5)
DAC_LRCK_1: ADAU1452KCPZ (DD4.42), U_DAC_AK4493SEQ (DD1B.5)
DAC_LRCK_2: ADAU1452KCPZ (DD4.47), U_DAC_AK4493SEQ (DD1C.5)
DAC_LRCK_3: AMPURR (DD2.14), ADAU1452KCPZ (DD4.50)
IN0_BCLK: AMPURR (DD6.15), ADAU1452KCPZ (DD4.57)
IN0_LRCLK: AMPURR (DD6.14), ADAU1452KCPZ (DD4.58)
IN0_SDATA: AMPURR (DD6.13), ADAU1452KCPZ (DD4.59)
IN1_BCLK: ADC_AK5572 (DD3.25), ADAU1452KCPZ (DD4.60)
IN1_LRCLK: ADC_AK5572 (DD3.26), ADAU1452KCPZ (DD4.61)
IN1_SDATA: ADC_AK5572 (DD3.28), ADAU1452KCPZ (DD4.62)
MCLK: AMPURR (DD2.12), ADC_AK5572 (DD3.16), ADAU1452KCPZ (DD4.23), U_DAC_AK4493SEQ (DD1A.46), U_DAC_AK4493SEQ (DD1B.46), U_DAC_AK4493SEQ (DD1C.46)
NetC43_1: AMPURR (C43.1 R23.1 VT4.3), ADAU1452KCPZ (R89.2)
NetC86_1: AMPURR (K1.8), ADC_AK5572 (C86.1 R53.2 R66.2)
NetC117_1: AMPURR (K1.3), ADC_AK5572 (C117.1 R76.2 R78.2)
NetC153_2: AMPURR (X4.1), PHONO_PREAMP (C153.2 DA6.5 R98.2)
NetC158_1: AMPURR (K1.4), PHONO_PREAMP (C158.1 DA7.7 R99.2)
NetC159_2: AMPURR (X5.1), PHONO_PREAMP (C159.2 DA6.3 R108.2)
NetC164_1: AMPURR (K1.7), PHONO_PREAMP (C164.1 DA7.1 R109.2)
NetDD4_45: AMPURR (VT2.1), ADAU1452KCPZ (DD4.45)
NetK2A_1: AMPURR (R37.1 R68.1 VD2.1), U_DAC_AK4493SEQ (K2A.1), U_DAC_AK4493SEQ (K2B.1), U_DAC_AK4493SEQ (K2C.1)
NetK2A_3: AMPURR (XP4.1 XP6.1), U_DAC_AK4493SEQ (K2A.3)
NetK2A_6: AMPURR (XP2.1 XP3.1), U_DAC_AK4493SEQ (K2A.6)
NetK2A_8: AMPURR (VD2.2 VT5.3), U_DAC_AK4493SEQ (K2A.8), U_DAC_AK4493SEQ (K2B.8), U_DAC_AK4493SEQ (K2C.8)
NetK2B_3: AMPURR (XP7.1 XP11.1), U_DAC_AK4493SEQ (K2B.3)
NetK2B_6: AMPURR (XP5.1 XP10.1), U_DAC_AK4493SEQ (K2B.6)
NetK2C_3: AMPURR (XP9.1 XP13.1), U_DAC_AK4493SEQ (K2C.3)
NetK2C_6: AMPURR (XP8.1 XP12.1), U_DAC_AK4493SEQ (K2C.6)
NetR8A_1: AMPURR (R35.1 VT2.3), ADC_AK5572 (R80.1), U_DAC_AK4493SEQ (R8A.1), U_DAC_AK4493SEQ (R8B.1), U_DAC_AK4493SEQ (R8C.1)
SCL: AMPURR (DD6.10 XP?.2), ADC_AK5572 (DD3.33), ADAU1452KCPZ (DD4.31 R87.2), U_DAC_AK4493SEQ (DD1A.8), U_DAC_AK4493SEQ (DD1B.8), U_DAC_AK4493SEQ (DD1C.8)
SDA: AMPURR (DD6.11 XP?.1), ADC_AK5572 (DD3.31), ADAU1452KCPZ (DD4.30 R88.2), U_DAC_AK4493SEQ (DD1A.9), U_DAC_AK4493SEQ (DD1B.9), U_DAC_AK4493SEQ (DD1C.9)
SPDIFIN: AMPURR (R18.2), ADAU1452KCPZ (DD4.4)

## Assembly variants
x: alternate parts K1 -> IM06TS